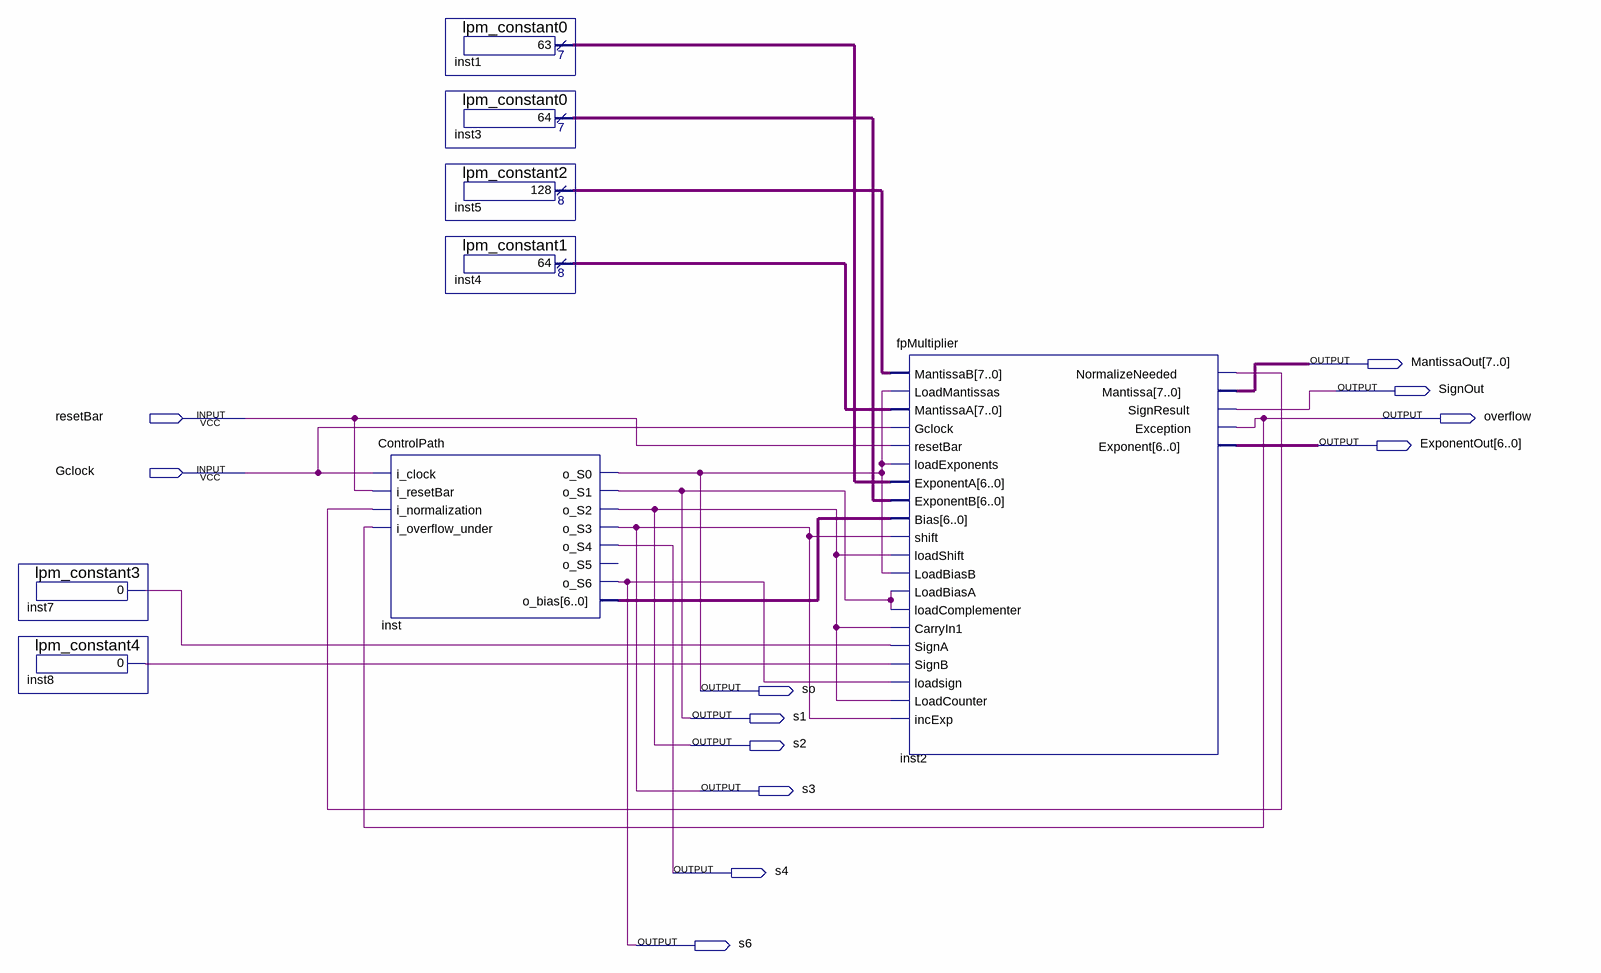
[diagram p0: schematic sheet]
// Quartus schematic toplevelmMULT.bdf as structural Verilog: 8 symbols, 12 pins
module toplevelmMULT (
  input  resetBar,
  input  Gclock,
  output [7:0] MantissaOut,
  output SignOut,
  output overflow,
  output [6:0] ExponentOut,
  output so,
  output s1,
  output s2,
  output s3,
  output s4,
  output s6
);

  wire inst2_normalizeneeded, inst7_result, inst8_result;
  wire [6:0] inst1_result, inst3_result, inst_o_bias;
  wire [7:0] inst4_result, inst5_result;

  lpm_constant3 inst7 (.result(inst7_result));
  lpm_constant4 inst8 (.result(inst8_result));
  ControlPath inst (
    .i_clock(Gclock), .i_resetBar(resetBar), .i_normalization(inst2_normalizeneeded),
    .i_overflow_under(overflow), .o_S0(so), .o_S1(s1), .o_S2(s2), .o_S3(s3), .o_S4(s4), .o_S6(s6),
    .o_bias(inst_o_bias));  // open: o_S5
  lpm_constant0 inst1 (.result(inst1_result));
  lpm_constant0 inst3 (.result(inst3_result));
  lpm_constant2 inst5 (.result(inst5_result));
  lpm_constant1 inst4 (.result(inst4_result));
  fpMultiplier inst2 (
    .MantissaB(inst5_result), .LoadMantissas(so), .MantissaA(inst4_result), .Gclock(Gclock),
    .resetBar(resetBar), .loadExponents(so), .ExponentA(inst1_result), .ExponentB(inst3_result),
    .Bias(inst_o_bias), .shift(s3), .loadShift(s2), .LoadBiasB(so), .LoadBiasA(s1), .loadComplementer(s1),
    .CarryIn1(s2), .SignA(inst7_result), .SignB(inst8_result), .loadsign(s6), .LoadCounter(s2), .incExp(s3),
    .NormalizeNeeded(inst2_normalizeneeded), .Mantissa(MantissaOut), .SignResult(SignOut),
    .Exception(overflow), .Exponent(ExponentOut));
endmodule
